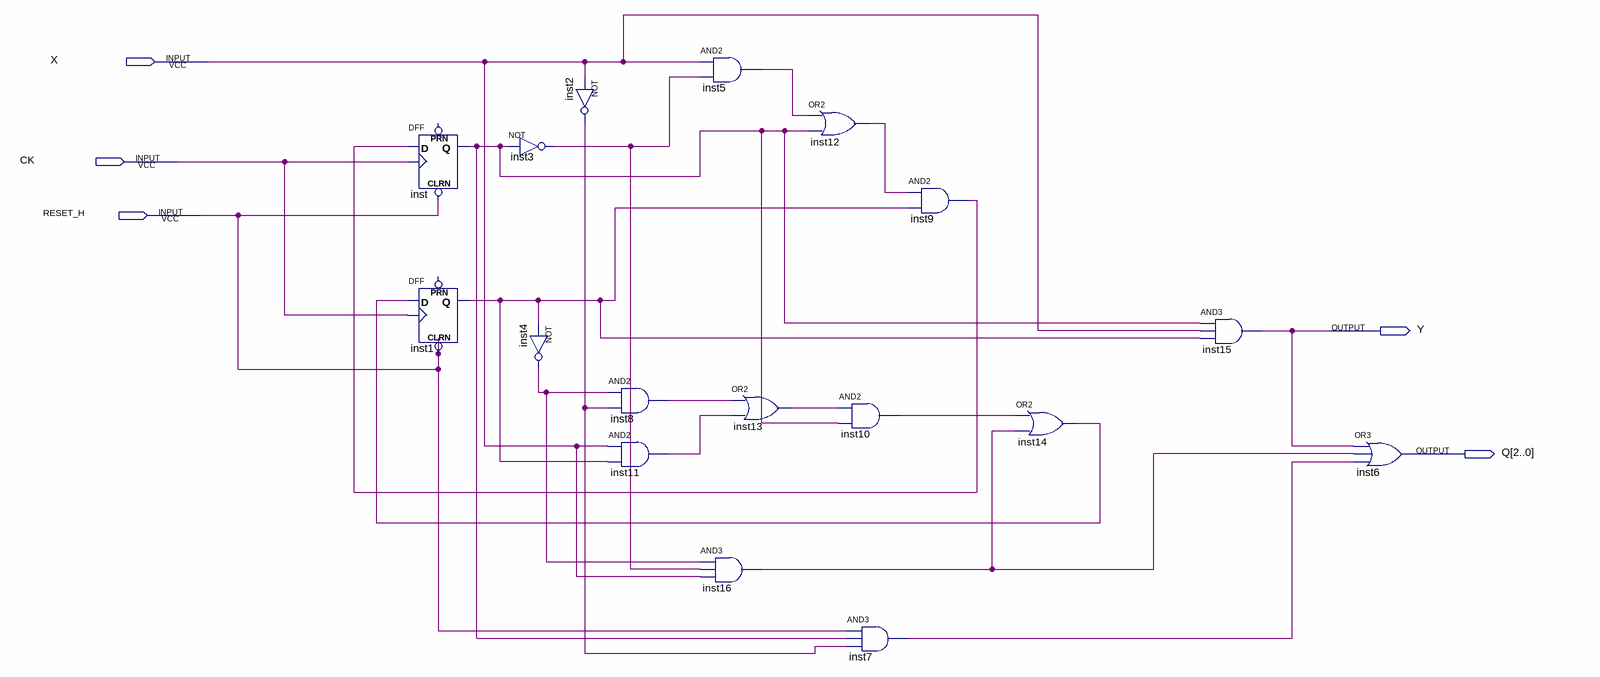
[diagram p0: schematic sheet]
// Quartus schematic MEF.bdf as structural Verilog: 17 symbols, 5 pins
module MEF (
  input  X,
  input  CK,
  input  RESET_H,
  output Y,
  output [2:0] Q
);

  wire inst1_q, inst2_out, inst3_out, inst4_out, inst5_out, inst7_out, inst8_out, inst9_out, inst10_out,
       inst11_out, inst12_out, inst13_out, inst14_out, inst16_out, inst_q;

  DFF inst (.CLRN(RESET_H), .CLK(CK), .D(inst9_out), .Q(inst_q));  // open: PRN
  DFF inst1 (.CLRN(RESET_H), .CLK(CK), .D(inst14_out), .Q(inst1_q));  // open: PRN
  not inst3 (inst3_out, inst_q);
  not inst4 (inst4_out, inst1_q);
  not inst2 (inst2_out, X);
  and inst8 (inst8_out, inst4_out, inst2_out);
  and inst11 (inst11_out, X, inst1_q);
  and inst5 (inst5_out, X, inst3_out);
  or inst13 (inst13_out, inst8_out, inst11_out);
  and inst16 (inst16_out, inst4_out, inst3_out, X);
  or inst12 (inst12_out, inst5_out, inst_q);
  and inst10 (inst10_out, inst13_out, inst_q);
  and inst7 (inst7_out, RESET_H, inst_q, inst2_out);
  and inst9 (inst9_out, inst12_out, inst1_q);
  or inst14 (inst14_out, inst10_out, inst16_out);
  and inst15 (Y, inst_q, X, inst1_q);
  assign Q = {3{Y}} | {3{inst16_out}} | {3{inst7_out}};  // OR3 inst6, 3 bits wide
endmodule
